# Altium schematic sheet Schematic.SchDoc
size A4
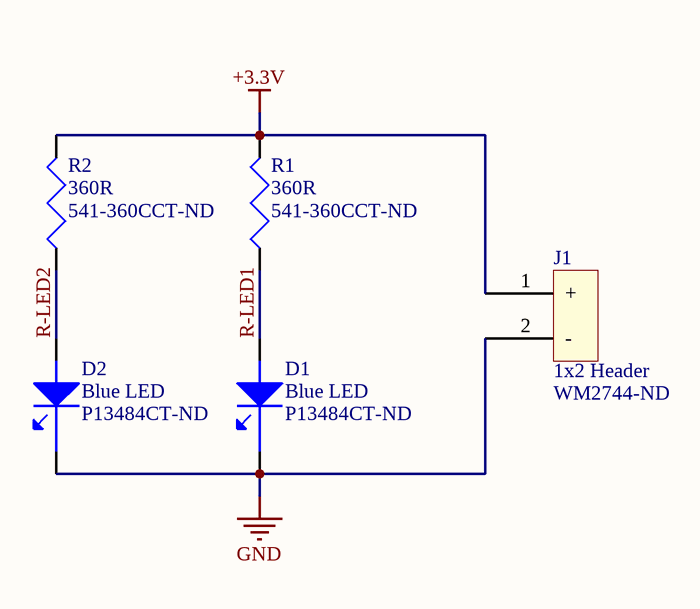
[diagram p0: Schematic.SchDoc]

## Parts
D1  Blue LED  Supplier Part Number 1: P13484CT-ND  [LED0603B]
D2  Blue LED  Supplier Part Number 1: P13484CT-ND  [LED0603B]
J1  1x2 Header  Supplier Part Number 1: WM2744-ND  [HDR1X2]
R1  360R  Supplier Part Number 1: 541-360CCT-ND  [R0805]
R2  360R  Supplier Part Number 1: 541-360CCT-ND  [R0805]

## Nets
+3.3V: J1.1(+) R1.2 R2.2
GND: D1.1 D2.1 J1.2(-)
R-LED1: D1.2 R1.1
R-LED2: D2.2 R2.1

## Library data of the parts
D1 D2 = LNJ926W8CRA: LED BLUE UTSS TYPE SMD; Manufacturer: Panasonic SSG; Bulb Size: 0.8mm x 1.6mm; Forward Current If: 5mA; Forward Voltage: 2.9V; Wavelength Typ: 470nm; Luminous Intensity: 11.5mcd; Lens Shape: Rectangular; SVHC: 1,3,5-Tris(oxiran-2-ylmethyl)-1,3,5-triazinane-2,4,6-trione (TGIC) (15-Jun-2015); Supplier 1: Digi-Key; Manufacturer Part Number: LNJ926W8CRA; Stock 1: 28564; Pricing 1: 1=0.36, 10=0.276, 100=0.2287, 500=0.2093, 1000=0.2024 (USD); LED Colour: Blue; LED Mounting: SMD; Viewing Angle: -; Packaging: Each; Product Range: -; Automotive Qualification Standard: -; MSL: -; ComponentLink1URL: http://www.farnell.com/datasheets/1915208.pdf?src-supplier=Element14; ComponentLink1Description: http://www.farnell.com/datasheets/1915208.pdf?src-supplier=Element14; ComponentLink2URL: http://www.mouser.com/ds/2/315/LNJ926W8CRA_CEK-226062.pdf?src-supplier=Mouser; ComponentLink2Description: http://www.mouser.com/ds/2/315/LNJ926W8CRA_CEK-226062.pdf?src-supplier=Mouser; Category: LED
J1 = 22-29-2021: Conn Wire to Board HDR 2 POS 2.54mm Solder ST Thru-Hole Bag; Manufacturer: Molex; ECCN (US): EAR99; Number of Contacts: 2; Body Orientation: Straight; Maximum Current Rating (A): 4/Contact; Maximum Voltage Rating: 500V; Insulation Resistance (MOhm): 1000; Maximum Contact Resistance (mOhm): 10; Mating Cycle (Cycles): 25; Product Weight (g): 0.216; Product Length (mm): 5.08; Product Depth (mm): 5.8; Product Height (mm): 11.7; Supplier 1: Digi-Key; Manufacturer Part Number: 22-29-2021; Stock 1: 18862; Pricing 1: 1=0.48, 10=0.452, 100=0.3163, 500=0.2711, 1000=0.2259, 5000=0.1937, 10000=0.1807 (USD); Tradename: KK®; Mounting: Through Hole; Part Status: Active; HTS: 8536.69.40.40; Type: Wire to Board; Gender: HDR; Number of Rows: 1; Termination Method: Solder; Terminal Pitch (mm): 2.54; Minimum Operating Temperature (°C): -40; Maximum Operating Temperature (°C): 80; Packaging: Bag; ComponentLink1URL: https://www.molex.com/pdm_docs/sd/022292021_sd.pdf?src-supplier=Digi-Key; ComponentLink1Description: https://www.molex.com/pdm_docs/sd/022292021_sd.pdf?src-supplier=Digi-Key; Category: Connectors
R1 R2 = CRCW0805360RFKEA: RES SMD 360 OHM 1% 1/8W 0805; Manufacturer: Vishay; ECCN (US): EAR99; Resistance Value (Ohm): 360; Maximum Voltage Rating (V): 150; Current Sensing: No; Power Rating (W): 0.125 (1/8); Temperature Coefficient (ppm/°C): ±100; Product Length (mm): 2; Product Depth (mm): 1.25; Product Height (mm): 0.45; Product Weight (g): 0.0055; Supplier 1: Digi-Key; Manufacturer Part Number: CRCW0805360RFKEA; Stock 1: 5538; Pricing 1: 1=0.1, 10=0.062, 100=0.0254, 1000=0.0114, 2500=0.0099 (USD); EU RoHS: Compliant with Exemption; Part Status: Active; Tolerance: 1%; Technology: Thick Film; Minimum Operating Temperature (°C): -55; Maximum Operating Temperature (°C): 155; Temperature Range @ Derated Power (: 70 to 155; Fail Safe Fusible Resistor: No; Anti-Surge: No; Anti-Sulfurated: No; Case Size: 805; Termination Style: Pad; Number of Terminals: 2; Packaging: Tape and Reel; Package Type: SMD; Package Shape: Rectangular; Package/Case: 805; Length Tolerance (mm): -0.1|+0.2; Depth Tolerance (mm): ±0.15; Height Tolerance (mm): ±0.05; Mounting: Surface Mount; ComponentLink1URL: http://www.vishay.com/docs/20035/dcrcwe3.pdf?src-supplier=Digi-Key; ComponentLink1Description: http://www.vishay.com/docs/20035/dcrcwe3.pdf?src-supplier=Digi-Key; Category: Resistors